# Altium schematic sheet 11.SchDoc
size 420 x 297 mm
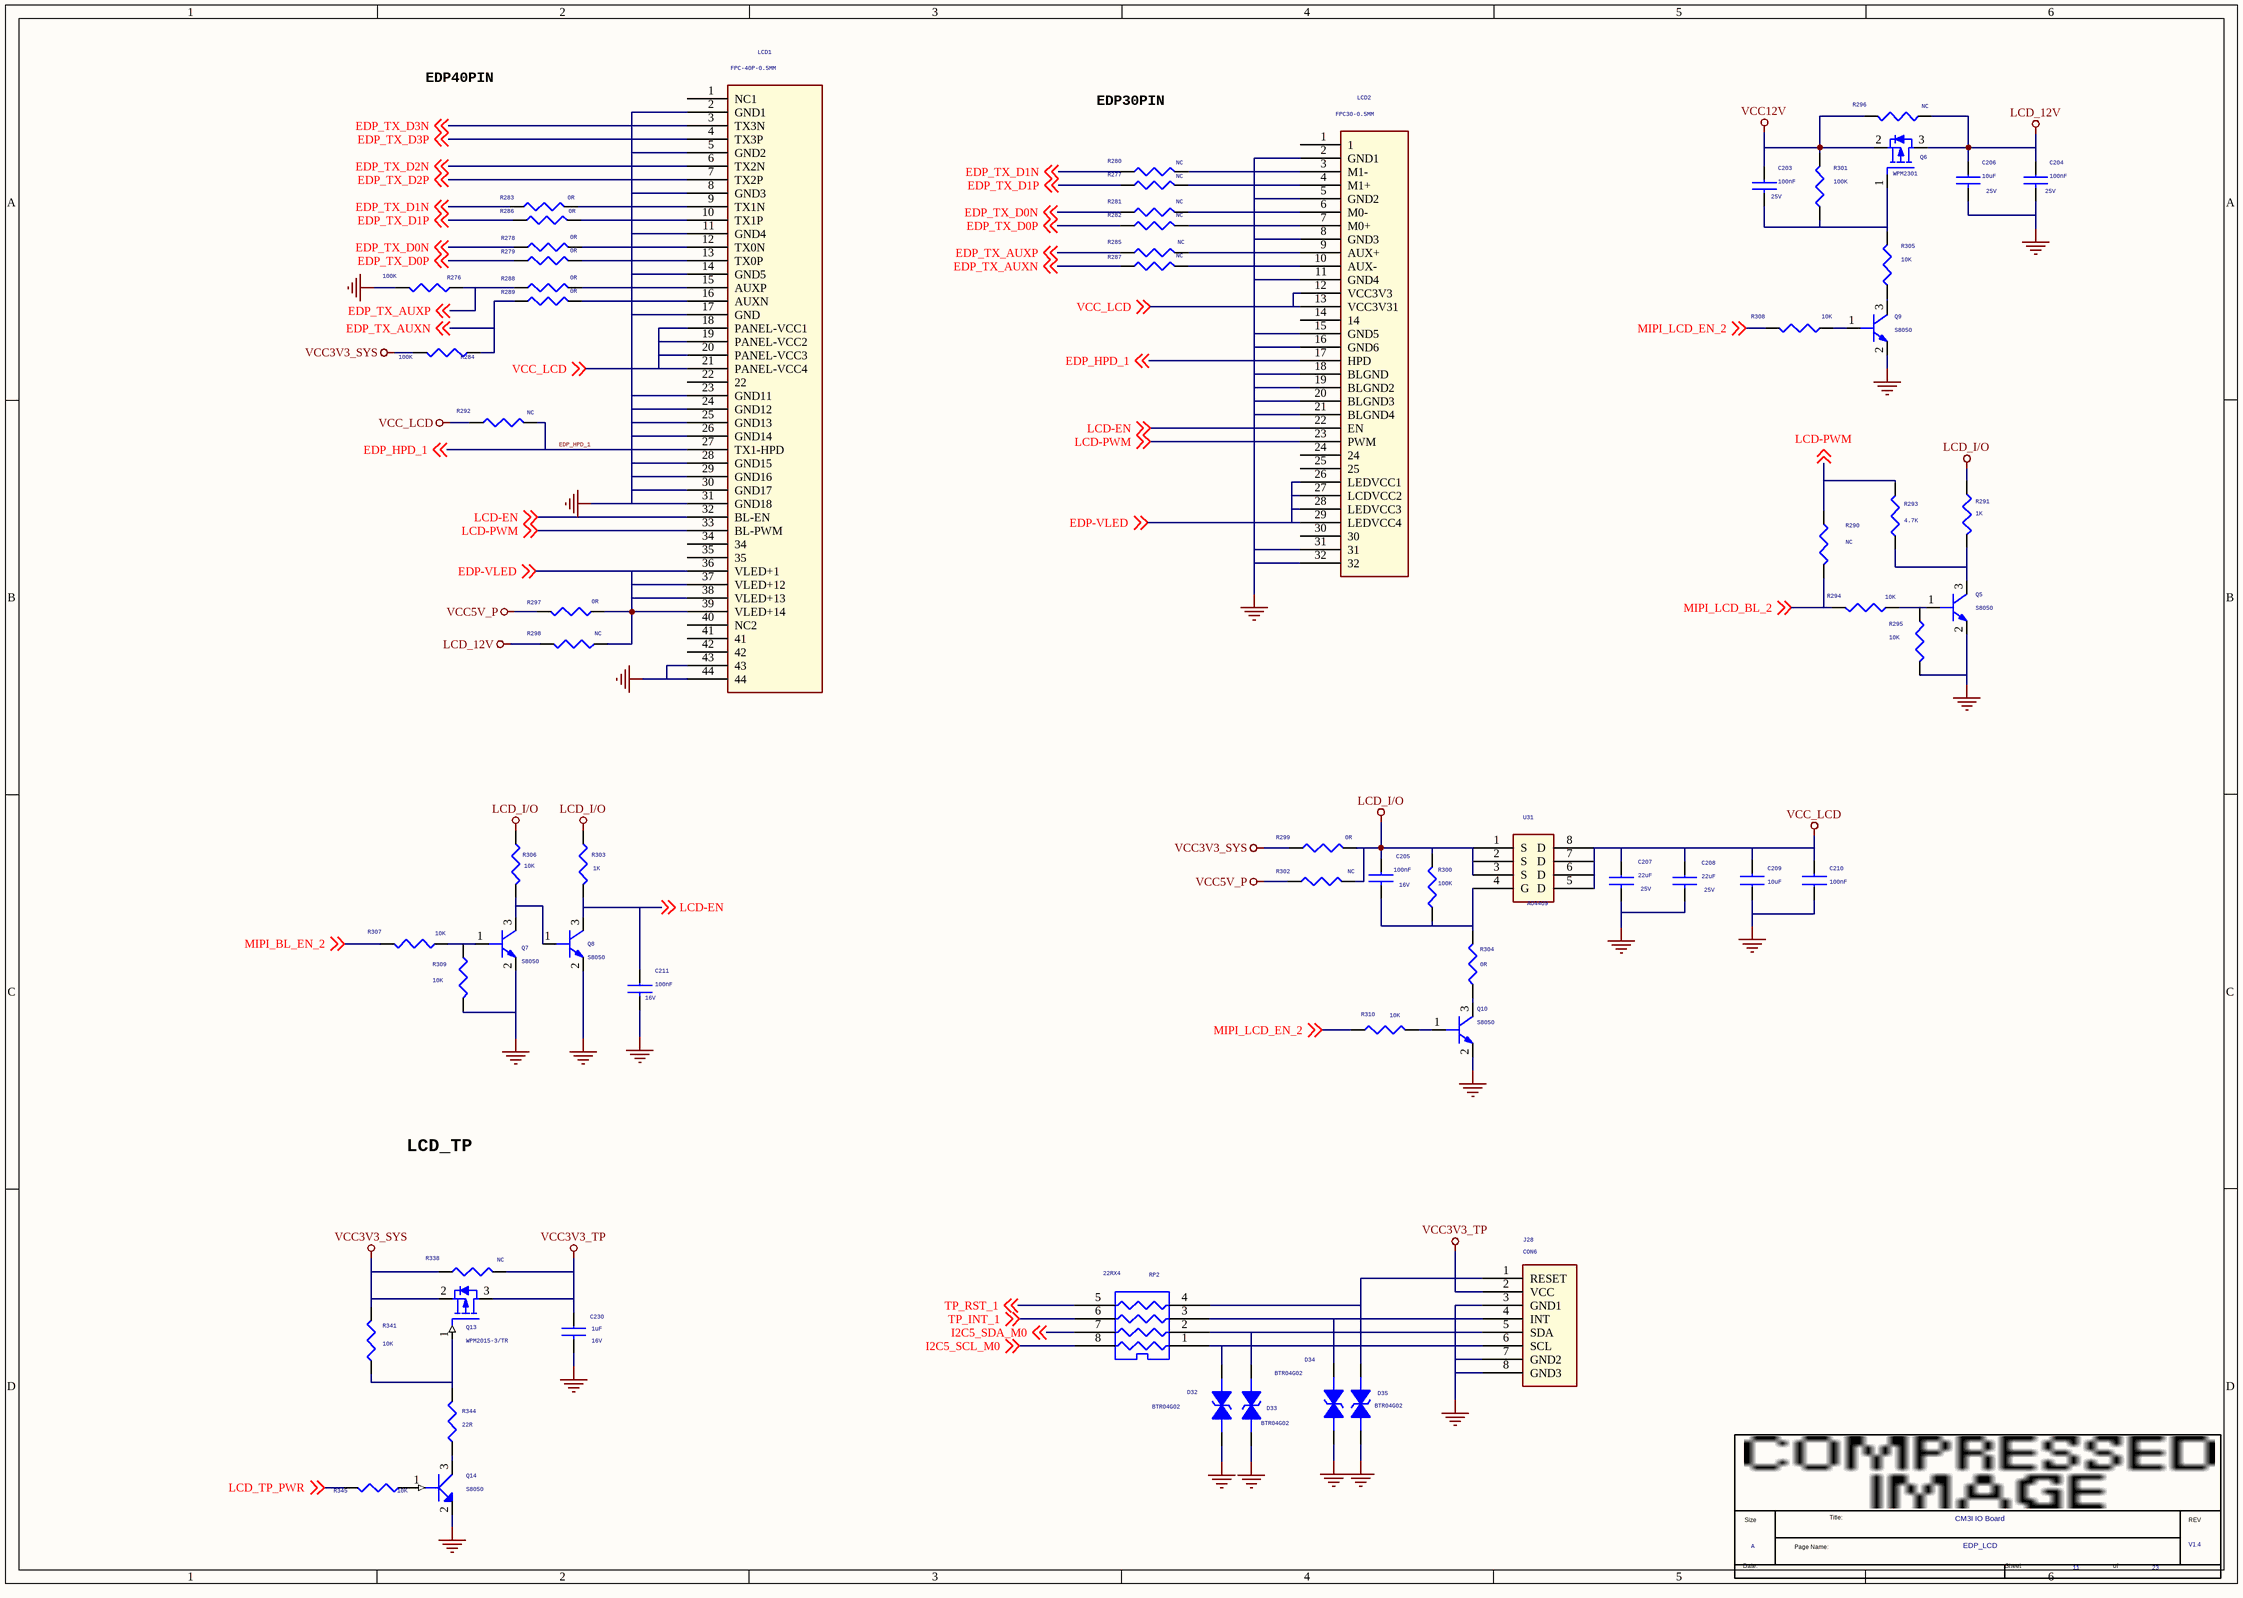
[diagram p0: 11.SchDoc]

## Parts
*  Page Count: 23  Page Number: 11  Page Size: A  Title: CM3I IO Board  RevCode: V1.4  Doc: EDP_LCD  (hidden comment: radxa_1010)  (graphical)
C203  100nF  Voltage: 25V  [C0402]
C204  100nF  Voltage: 25V  [C0402]
C205  100nF  Voltage: 16V  [C0402]
C206  10uF  Voltage: 25V  [C0805]
C207  22uF  Voltage: 25V  [C0603]
C208  22uF  Voltage: 25V  [C0603]
C209  10uF  [C0603]
C210  100nF  [C0603]
C211  100nF  Voltage: 16V  [C0402]
C230  1uF  Voltage: 16V  [C0402]
D32  BTR04G02  [ESD0402_1xD5]
D33  BTR04G02  [ESD0402_1xD5]
D34  BTR04G02  [ESD0402_1xD5]
D35  BTR04G02  [ESD0402_1xD5]
J28  CON6  [FPC6-0.5MM-2660H]
LCD1  FPC-40P-0.5MM  [EDP_1]
LCD2  FPC30-0.5MM  [EDP30PIN]
Q5  S8050  [SOT_23]
Q6  WPM2301  [SOT23]
Q7  S8050  [SOT_23]
Q8  S8050  [SOT_23]
Q9  S8050  [SOT23]
Q10  S8050  [SOT23]
Q13  WPM2015-3/TR  [SOT23]
Q14  S8050  [SOT23]
R276  100K  [R0402]
R277  NC  [R0402]
R278  0R  [R0402]
R279  0R  [R0402]
R280  NC  [R0402]
R281  NC  [R0402]
R282  NC  [R0402]
R283  0R  [R0402]
R284  100K  [R0402]
R285  NC  [R0402]
R286  0R  [R0402]
R287  NC  [R0402]
R288  0R  [R0402]
R289  0R  [R0402]
R290  NC  [R0402]
R291  1K  [R0402]
R292  NC  [R0402]
R293  4.7K  [R0402]
R294  10K  [R0402]
R295  10K  [R0402]
R296  NC  [R0402]
R297  0R  [R0603]
R298  NC  [R0603]
R299  0R  [R0402]
R300  100K  [R0402]
R301  100K  [R0402]
R302  NC  [R0402]
R303  1K  [R0402]
R304  0R  [R0402]
R305  10K  [R0402]
R306  10K  [R0402]
R307  10K  [R0402]
R308  10K  [R0402]
R309  10K  [R0402]
R310  10K  [R0402]
R338  NC  [R0402]
R341  10K  [R0402]
R344  22R  [R0402]
R345  10K  [R0402]
RP2  22RX4  [RN8P4RC]
U31  AO4409  [SOP8-50-150]

## Nets
GND: C204.2 C206.2 C207.2 C208.2 C209.2 C210.2 C211.2 C230.2 D32.1 D33.1 D34.1 D35.1 J28.3(GND1) J28.7(GND2) J28.8(GND3) LCD1.2(GND1) LCD1.5(GND2) LCD1.8(GND3) LCD1.11(GND4) LCD1.14(GND5) LCD1.17(GND) LCD1.23(GND11) LCD1.24(GND12) LCD1.25(GND13) LCD1.26(GND14) LCD1.28(GND15) LCD1.29(GND16) LCD1.30(GND17) LCD1.31(GND18) LCD1.43 LCD1.44 LCD2.2(GND1) LCD2.5(GND2) LCD2.8(GND3) LCD2.11(GND4) LCD2.15(GND5) LCD2.16(GND6) LCD2.18(BLGND) LCD2.19(BLGND2) LCD2.20(BLGND3) LCD2.21(BLGND4) LCD2.31 LCD2.32 Q5.2(EMITTER) Q7.2(EMITTER) Q8.2(EMITTER) Q9.2(EMITTER) Q10.2(EMITTER) Q14.2(E) R276.2 R295.1 R309.1
LCD_12V: C204.1 C206.1 Q6.3(DRAIN) R296.2 R298.1
LCD_I/O: C205.1 R291.2 R299.2 R300.1 R302.2 R303.2 R306.2 U31.1(S) U31.2(S) U31.3(S)
VCC3V3_SYS: Q13.2(SOURCE) R284.2 R299.1 R338.1 R341.2
VCC3V3_TP: C230.1 J28.2(VCC) Q13.3(DRAIN) R338.2
VCC5V_P: R297.1 R302.1
VCC12V: C203.1 Q6.2(SOURCE) R296.1 R301.1
VCC_LCD: C207.1 C208.1 C209.1 C210.1 LCD1.18(PANEL-VCC1) LCD1.19(PANEL-VCC2) LCD1.20(PANEL-VCC3) LCD1.21(PANEL-VCC4) LCD2.12(VCC3V3) LCD2.13(VCC3V31) R292.1 U31.5(D) U31.6(D) U31.7(D) U31.8(D) ; off-sheet VCC_LCD
EDP-VLED: LCD1.36(VLED+1) LCD1.37(VLED+12) LCD1.38(VLED+13) LCD1.39(VLED+14) LCD2.26(LEDVCC1) LCD2.27(LCDVCC2) LCD2.28(LEDVCC3) LCD2.29(LEDVCC4) R297.2 R298.2 ; off-sheet EDP-VLED
EDP_HPD_1: LCD1.27(TX1-HPD) LCD2.17(HPD) R292.2 ; off-sheet EDP_HPD_1
EDP_TX_AUXN: R284.1 R287.2 R289.2 ; off-sheet EDP_TX_AUXN
EDP_TX_AUXP: R276.1 R285.2 R288.2 ; off-sheet EDP_TX_AUXP
EDP_TX_D0N: R278.2 R281.2 ; off-sheet EDP_TX_D0N
EDP_TX_D0P: R279.2 R282.2 ; off-sheet EDP_TX_D0P
EDP_TX_D1N: R280.2 R283.2 ; off-sheet EDP_TX_D1N
EDP_TX_D1P: R277.2 R286.2 ; off-sheet EDP_TX_D1P
EDP_TX_D2N: LCD1.6(TX2N) ; off-sheet EDP_TX_D2N
EDP_TX_D2P: LCD1.7(TX2P) ; off-sheet EDP_TX_D2P
EDP_TX_D3N: LCD1.3(TX3N) ; off-sheet EDP_TX_D3N
EDP_TX_D3P: LCD1.4(TX3P) ; off-sheet EDP_TX_D3P
I2C5_SCL_M0: RP2.8(R1) ; off-sheet I2C5_SCL_M0
I2C5_SDA_M0: RP2.7(R2) ; off-sheet I2C5_SDA_M0
LCD-EN: C211.1 LCD1.32(BL-EN) LCD2.22(EN) Q8.3(COLLECTOR) R303.1 ; off-sheet LCD-EN
LCD-PWM: LCD1.33(BL-PWM) LCD2.23(PWM) R290.2 R293.1 ; off-sheet LCD-PWM
LCD_TP_PWR: R345.2 ; off-sheet LCD_TP_PWR
MIPI_BL_EN_2: R307.1 ; off-sheet MIPI_BL_EN_2
MIPI_LCD_BL_2: R290.1 R294.1 ; off-sheet MIPI_LCD_BL_2
MIPI_LCD_EN_2: R308.1 R310.1 ; off-sheet MIPI_LCD_EN_2
TP_INT_1: RP2.6(R3) ; off-sheet TP_INT_1
TP_RST_1: RP2.5(R4) ; off-sheet TP_RST_1
NetC203_2: C203.2 Q6.1(GATE) R301.2 R305.1
NetC205_2: C205.2 R300.2 R304.1 U31.4(G)
NetD32_2: D32.2 J28.6(SCL) RP2.1(R1)
NetD33_2: D33.2 J28.5(SDA) RP2.2(R2)
NetD34_2: D34.2 J28.4(INT) RP2.3(R3)
NetD35_2: D35.2 J28.1(RESET) RP2.4(R4)
NetLCD1_9: LCD1.9(TX1N) R283.1
NetLCD1_10: LCD1.10(TX1P) R286.1
NetLCD1_12: LCD1.12(TX0N) R278.1
NetLCD1_13: LCD1.13(TX0P) R279.1
NetLCD1_15: LCD1.15(AUXP) R288.1
NetLCD1_16: LCD1.16(AUXN) R289.1
NetLCD2_3: LCD2.3(M1-) R280.1
NetLCD2_4: LCD2.4(M1+) R277.1
NetLCD2_6: LCD2.6(M0-) R281.1
NetLCD2_7: LCD2.7(M0+) R282.1
NetLCD2_9: LCD2.9(AUX+) R285.1
NetLCD2_10: LCD2.10(AUX-) R287.1
NetQ5_1: Q5.1(BASE) R294.2 R295.2
NetQ5_3: Q5.3(COLLECTOR) R291.1 R293.2
NetQ7_1: Q7.1(BASE) R307.2 R309.2
NetQ7_3: Q7.3(COLLECTOR) Q8.1(BASE) R306.1
NetQ9_1: Q9.1(BASE) R308.2
NetQ9_3: Q9.3(COLLECTOR) R305.2
NetQ10_1: Q10.1(BASE) R310.2
NetQ10_3: Q10.3(COLLECTOR) R304.2
NetQ13_1: Q13.1(GATE) R341.1 R344.2
NetQ14_1: Q14.1(B) R345.1
NetQ14_3: Q14.3(C) R344.1

Not connected (* = marked no-connect by the designer): LCD1 1(NC1) 22 34 35 40(NC2) 41 42; LCD2 1 14 24 25 30

## Notes on the sheet
- EDP40PIN
- EDP30PIN
- LCD_TP
- (in symbol radxa_1010) Size; Title:; REV; Page Name:; Date:; Sheet; of

## Library data of the parts
C203 C204 = CAP NP_0: cap,100.00nF,+/-10%,16V,X5R,C0402; Manufacturer: TDK; RK PN: C1005X5R1C104K050BA; Priority: A; Tolerance: 10%; Dielectric: X5R; Part Type: C0402; Manufacturer PN: C1005X5R1C104K050BA; Created by: JJJ
C205 C211 C230 = CAP NP_0: cap,100.00nF,+/-10%,6.3V,X5R,C0402; Manufacturer: TDK; RK PN: C1005X5R0J104K050BA; Priority: A; Tolerance: 10%; Dielectric: X5R; Part Type: C0402; Manufacturer PN: C1005X5R0J104K050BA; Created by: JJJ
C206 = CAP NP_0: cap,10.00uF,+/-10%,6.3V,X5R,C0603; Manufacturer: TDK; RK PN: C1608X5R0J106K080AB; Priority: A; Tolerance: 10%; Dielectric: X5R; Part Type: C0603; Manufacturer PN: C1608X5R0J106K080AB; Created by: JJJ
C207 = CAP NP_0: cap,4.70uF,+/-10%,6.3V,X5R,C0603; Manufacturer: TDK; RK PN: C1608X5R0J475K080AB; Priority: A; Tolerance: 10%; Dielectric: X5R; Part Type: C0603; Manufacturer PN: C1608X5R0J475K080AB; Created by: JJJ
C208 = CAP NP_0: cap,4.70uF,+/-10%,6.3V,X5R,C0603; Manufacturer PN: C1608X5R0J475K080AB; Manufacturer: TDK; Tolerance: 10%; Priority: A; Dielectric: X5R; Created by: JJJ; Part Type: C0603; RK PN: C1608X5R0J475K080AB
C209 = CAP NP_Dup2: CAP,MLCC,4.7uF,+/-10%,X5R,6.3V,SMD0603
C210 = CAP NP_Dup2: CAP,MLCC,100nF,+/-10%,X7R,6.3V,SMD0402
D32 D34 D35 = DIODE BI_DIR TRIG_0: 1-Line, Bi-directional, Transient Voltage Suppressors.17.5pF.; Manufacturer PN: ESD5451N; Manufacturer: WillSemi(韦尔半导体); OPTION: DNP; Priority: A; Created by: JJJ; Part Type: ESD_TVS; RK PN: ESD5451N
D33 = DIODE BI_DIR TRIG_0: 1-Line, Bi-directional, Transient Voltage Suppressors.17.5pF.; Manufacturer: WillSemi(韦尔半导体); RK PN: ESD5451N; Priority: A; OPTION: DNP; Part Type: ESD_TVS; Manufacturer PN: ESD5451N; Created by: JJJ
J28 = CON6_1
LCD1 = EDP_0
LCD2 = EDP30PIN
Q5 Q8 Q10 = NPN: S8050 SOT23; Manufacturer: 长电; Manufacturer PN: S8050_SOT23; Priority: A; Ic: 0.5A; Vceo: 25V; Pc: 0.3W; RK PN: S8050; Part Type: NPN; Created by: JJJ
Q6 = MOSFET P_Dup1: PMOS,WPM3407-3/TR,SOT_23,Id=4.4A,Vds=30V; Manufacturer: WillSemi(韦尔半导体); Pd: 0.9W; Vgsth: 2.0V; VDS: 30V; Vgs: ±20V; Id_max: 4.4A; Priority: A; Created by: JJJ; Manufacturer PN: WPM3407-3/TR; Part Type: PMOS; RK PN: WPM3407-3/TR
Q7 = NPN: S8050 SOT23; Manufacturer PN: S8050_SOT23; Manufacturer: 长电; Pc: 0.3W; Vceo: 25V; Ic: 0.5A; Priority: A; Created by: JJJ; Part Type: NPN; RK PN: S8050
Q9 = NPN: S8050,SOT23; Manufacturer PN: S8050_SOT23; Manufacturer: 长电; Pc: 0.3W; Vceo: 25V; Ic: 0.5A; Priority: A; Created by: JJJ; Part Type: NPN; RK PN: S8050
Q13 = MOSFET P: PMOS,WPM2015-3/TR,SOT_23,Id=2.4A,Vds=20V; Manufacturer: WillSemi(韦尔半导体); ROOM: CHG; Priority: A; Id_max: 2.4A; Vgs: ±8V; VDS: 20V; Vgsth: 0.62V; Pd: 0.5W; option: DNP; RK PN: WPM2015-3/TR; Part Type: PMOS; Manufacturer PN: WPM2015-3/TR; Created by: JJJ
Q14 = NPN4
R276 R284 = RESISTOR_1
R277-R279 R282 R283 R285 R288 R289 = RESISTOR_0_Dup1: 通用厚膜电阻,22R,+/-5%,R0402,1/16W.; Manufacturer PN: RC0402JR-0722RL; Manufacturer: YAGEO; Tolerance: 5%; Wattage: 1/16W; Priority: A; Created by: YTL; Part Type: 通用厚膜电阻; RK PN: RC0402JR-0722RL
R280 R281 R286 R287 = RESISTOR_0_Dup1: 通用厚膜电阻,22R,+/-5%,R0402,1/16W.; Manufacturer: YAGEO; Tolerance: 5%; RK PN: RC0402JR-0722RL; Priority: A; Wattage: 1/16W; Part Type: 通用厚膜电阻; Manufacturer PN: RC0402JR-0722RL; Created by: YTL
R290 R293 R296 R299 R303 R306 R308 R341 = RESISTOR_0_Dup1: 通用厚膜电阻,10K,+/-5%,R0402,1/16W.; Manufacturer: YAGEO; Tolerance: 5%; RK PN: RC0402JR-0710KL; Priority: A; Wattage: 1/16W; Part Type: 通用厚膜电阻; Manufacturer PN: RC0402JR-0710KL; Created by: YTL
R291 R294 R295 R302 R304 R305 R307 R309 R310 = RESISTOR_0_Dup1: 通用厚膜电阻,10K,+/-5%,R0402,1/16W.; Manufacturer PN: RC0402JR-0710KL; Manufacturer: YAGEO; Tolerance: 5%; Wattage: 1/16W; Priority: A; Created by: YTL; Part Type: 通用厚膜电阻; RK PN: RC0402JR-0710KL
R292 = RES 1B: ROHS CHIP RES 4.7K 1/16W 5%
R297 R298 = RES 1B: ROHS CHIP RES 4.7R 1/4W 5%
R300 = RESISTOR_0_Dup1: 通用厚膜电阻,100K,+/-5%,R0402,1/16W.; Manufacturer PN: RC0402JR-07100KL; Manufacturer: YAGEO; Tolerance: 5%; Wattage: 1/16W; Priority: A; Created by: YTL; Part Type: 通用厚膜电阻; RK PN: RC0402JR-07100KL
R301 R345 = RESISTOR_0_Dup1: 通用厚膜电阻,100K,+/-5%,R0402,1/16W.; Manufacturer: YAGEO; Tolerance: 5%; RK PN: RC0402JR-07100KL; Priority: A; Wattage: 1/16W; Part Type: 通用厚膜电阻; Manufacturer PN: RC0402JR-07100KL; Created by: YTL
R338 = RESISTOR_0_Dup1: 通用厚膜电阻,0R,+/-5%,R0402,1/16W.; Manufacturer PN: RC0402JR-070RL; Manufacturer: YAGEO; Tolerance: 5%; Wattage: 1/16W; Priority: A; Created by: YTL; Part Type: 通用厚膜电阻; RK PN: RC0402JR-070RL
R344 = RESISTOR_0_Dup6
RP2 = R-PACK4
U31 = AO4409_0
* = radxa_1010: Page Create Date: March  8, 1995